# Altium schematic sheet CAN.SchDoc
size A3; SheetNumber: 8; SheetTotal: 13
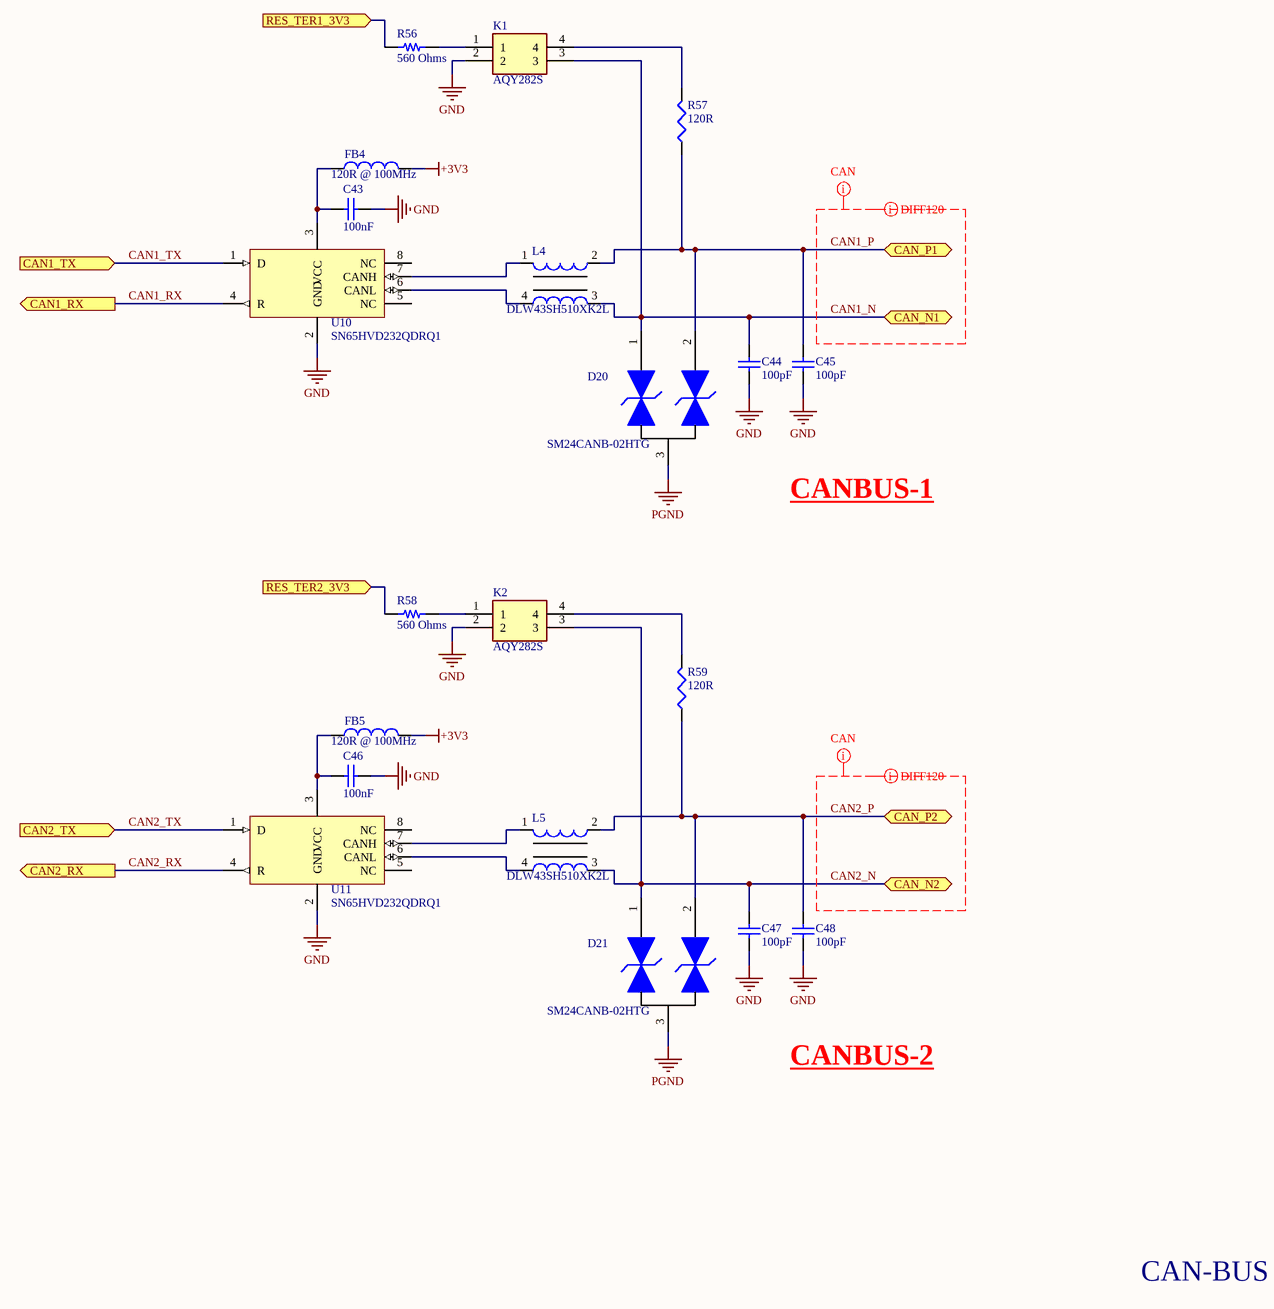
[diagram p0: CAN.SchDoc]

## Parts
C43  100nF  [CAP0603]
C44  100pF  [CAP0603]
C45  100pF  [CAP0603]
C46  100nF  [CAP0603]
C47  100pF  [CAP0603]
C48  100pF  [CAP0603]
D20  P/N: SM24CANB-02HTG  [SOT23_3-DIODE]  (hidden comment: CAN)
D21  P/N: SM24CANB-02HTG  [SOT23_3-DIODE]  (hidden comment: CAN)
FB4  120R @ 100MHz  [FB0603]
FB5  120R @ 100MHz  [FB0603]
K1  AQY282S  [SOP254P680X230-4N]
K2  AQY282S  [SOP254P680X230-4N]
L4  P/N: DLW43SH510XK2L  [CMC_DLW43SH510XK2L]  (hidden comment: CMC_DLW43SH510XK2L)
L5  P/N: DLW43SH510XK2L  [CMC_DLW43SH510XK2L]  (hidden comment: CMC_DLW43SH510XK2L)
R56  560 Ohms  [RES 0603_1608]
R57  120R  [RES0603]
R58  560 Ohms  [RES 0603_1608]
R59  120R  [RES0603]
U10  P/N: SN65HVD232QDRQ1  [SOIC8]  (hidden comment: CAN)
U11  P/N: SN65HVD232QDRQ1  [SOIC8]  (hidden comment: CAN)

## Ports
CAN1_RX (out), CAN1_TX (in), CAN2_RX (out), CAN2_TX (in), CAN_N1 (bidir), CAN_N2 (bidir), CAN_P1 (bidir), CAN_P2 (bidir), RES_TER1_3V3 (in), RES_TER2_3V3 (in)

## Nets
+3V3: FB4.2 FB5.2
GND: C43.2 C44.1 C45.1 C46.2 C47.1 C48.1 K1.2 K2.2 U10.2(GND) U11.2(GND)
PGND: D20.3 D21.3
CAN1_N: C44.2 D20.1 K1.3 L4.3 ; port CAN_N1
CAN1_P: C45.2 D20.2 L4.2 R57.1 ; port CAN_P1
CAN1_RX: U10.4(R) ; port CAN1_RX
CAN1_TX: U10.1(D) ; port CAN1_TX
CAN2_N: C47.2 D21.1 K2.3 L5.3 ; port CAN_N2
CAN2_P: C48.2 D21.2 L5.2 R59.1 ; port CAN_P2
CAN2_RX: U11.4(R) ; port CAN2_RX
CAN2_TX: U11.1(D) ; port CAN2_TX
RES_TER1_3V3: R56.1 ; port RES_TER1_3V3
RES_TER2_3V3: R58.1 ; port RES_TER2_3V3
NetC43_1: C43.1 FB4.1 U10.3(VCC)
NetC46_1: C46.1 FB5.1 U11.3(VCC)
NetK1_1: K1.1 R56.2
NetK1_4: K1.4 R57.2
NetK2_1: K2.1 R58.2
NetK2_4: K2.4 R59.2
NetL4_1: L4.1 U10.7(CANH)
NetL4_4: L4.4 U10.6(CANL)
NetL5_1: L5.1 U11.7(CANH)
NetL5_4: L5.4 U11.6(CANL)

Not connected (* = marked no-connect by the designer): U10 5(NC) 8(NC); U11 5(NC) 8(NC)

## Layout directives
net class CAN1: CAN1_N, CAN1_P
differential pair: CAN1_N, CAN1_P, CAN2_N, CAN2_P
net class CAN2: CAN2_N, CAN2_P

## Notes on the sheet
- CANBUS-1
- CANBUS-2
- CAN-BUS

## Library data of the parts
C43 C46 = CAP0603_100nF: CAP CER 0.1UF 50V X7R 0603; P/N: C0603C104K5RACTU; Value: 100nF 50V; Order Code: DIGI : 399-5089-1-ND
C44 C45 C47 C48 = CAP0603_100pF: CAP CER 100PF 50V C0G/NP0 0603; P/N: C0603C101J5GACTU; Order Code: DIGI : 399-1061-1-ND; Value: 100pF 50V
D20 D21 = SM24CANB-02HTG_TVS: TVS DIODE 24VWM 50VC SOT23-3; Order Code: DIGI : F6707CT-ND; Value: 2Ch
FB4 FB5 = FB0603_120R@100MHz: FERRITE BEAD 120 OHM 0603 1LN; P/N: BLM18KG121TH1D; Order Code: DIGI : 490-13261-1-ND; Value: 120R @ 100MHz
K1 K2 = AQY282S: Relay or Contactor; Manufacturer_Name: Panasonic; Datasheet Link: https://datasheet.lcsc.com/szlcsc/PANASONIC-AQY282S_C129284.pdf; Height: 2.3mm; Manufacturer_Part_Number: AQY282S; Mouser Part Number: 769-AQY282S; Mouser Price/Stock: https://www.mouser.co.uk/ProductDetail/Panasonic-Industrial-Devices/AQY282S?qs=sEN%2FkO1EG6bFR4N8wKfhAA%3D%3D; Arrow Part Number: AQY282S; Arrow Price/Stock: https://www.arrow.com/en/products/aqy282s/panasonic?region=nac
L4 L5 = CMC_DLW43SH510XK2L: CMC 51UH 230MA 2LN SMD AEC-Q200; Order Code: DIGI : 490-7982-1-ND; Value: 51uH
R56 R58 = RMCF0603JT560R: RES 560 OHM 5% 1/10W 0603; Manufacturer: Stackpole Electronics Inc; Power (Watts): 0.1W, 1/10W; Temperature Coefficient: ±200ppm/°C; Part Number: RMCF0603JT560R; Value: 560 Ohms; ComponentLink1Description: Datasheet; ComponentLink1URL: https://www.seielect.com/catalog/sei-rmcf_rmcp.pdf; ComponentLink2Description: DigiKey Link; ComponentLink2URL: https://www.digikey.com/en/products/detail/stackpole-electronics-inc/RMCF0603JT560R/1712305; Composition: Thick Film; Device Package: 0603 (1608 Metric); Features: Automotive AEC-Q200; Height - Seated (Max): 0.022" (0.55mm); LastUpdated: 22.06.2022 13:19:51; Lifecycle Status: Active; Minimum Order: 1; Number of Terminations: 2; Operating Temperature: -55°C ~ 155°C; Package / Case: 0603 (1608 Metric); Packaging: CutTape; PartId: 5967; Part Status: Active; Price: 0.01; Ratings: AEC-Q200; Resistance: 560 Ohms; Series: RMCF; Size / Dimension: 0.061" L x 0.031" W (1.55mm x 0.80mm); Supplier 1: DigiKey; Supplier Part Number 1: RMCF0603JT560RCT-ND; Supplier Device Package: 0603; Tolerance: ±5%
R57 R59 = RES0603_120R: RES SMD 120 OHM 1% 1/10W 0603; Order Code: DIGI : 311-120HRCT-ND; P/N: RC0603FR-07120RL; ART Code: ART0023420; Value: 120R
U10 U11 = SN65HVD232QDRQ1_CAN: IC TRANSCEIVER HALF 1/1 8SOIC; Order Code: DIGI : 296-15381-1-ND; Value: CAN